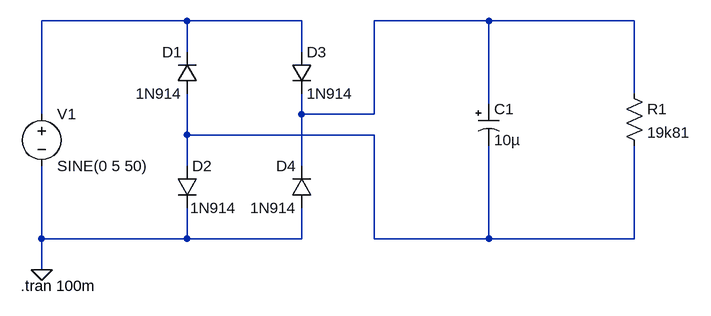
[diagram p0: schematic 2_half_period_rectifier.asc]
2_half_period_rectifier.asc, the LTspice schematic file:
Version 4
SHEET 1 1020 680
WIRE 240 -16 16 -16
WIRE 416 -16 240 -16
WIRE 704 -16 528 -16
WIRE 928 -16 704 -16
WIRE 240 32 240 -16
WIRE 416 32 416 -16
WIRE 928 96 928 -16
WIRE 704 112 704 -16
WIRE 16 128 16 -16
WIRE 416 128 416 96
WIRE 528 128 528 -16
WIRE 528 128 416 128
WIRE 240 160 240 96
WIRE 528 160 240 160
WIRE 240 208 240 160
WIRE 416 208 416 128
WIRE 16 320 16 208
WIRE 240 320 240 272
WIRE 240 320 16 320
WIRE 416 320 416 272
WIRE 416 320 240 320
WIRE 528 320 528 160
WIRE 704 320 704 176
WIRE 704 320 528 320
WIRE 928 320 928 176
WIRE 928 320 704 320
WIRE 16 368 16 320
FLAG 16 368 0
SYMBOL voltage 16 112 R0
WINDOW 123 0 0 Left 2
WINDOW 39 0 0 Left 2
SYMATTR InstName V1
SYMATTR Value SINE(0 5 50)
SYMBOL diode 256 96 R180
WINDOW 0 24 64 Left 2
WINDOW 3 24 0 Left 2
SYMATTR InstName D1
SYMATTR Value 1N914
SYMBOL diode 224 208 R0
WINDOW 3 92 64 Right 2
SYMATTR Value 1N914
SYMATTR InstName D2
SYMBOL diode 400 32 R0
SYMATTR InstName D3
SYMATTR Value 1N914
SYMBOL diode 432 272 R180
WINDOW 0 24 64 Left 2
WINDOW 3 24 0 Left 2
SYMATTR InstName D4
SYMATTR Value 1N914
SYMBOL polcap 688 112 R0
SYMATTR InstName C1
SYMATTR Value 10µ
SYMBOL res 912 80 R0
SYMATTR InstName R1
SYMATTR Value 19k81
TEXT -16 392 Left 2 !.tran 100m

The netlist it stands for:
* 2_half_period_rectifier.asc
V1 N001 0 SINE(0 5 50)
D1 N003 N001 1N914
D2 N003 0 1N914
D3 N001 N002 1N914
D4 0 N002 1N914
C1 N002 N003 10µ
R1 N002 N003 19k81
.model D D
.lib standard.dio
.tran 100m
.backanno
.end